# EAGLE design 1GHz Elektor Probe (EAGLE 6.1)
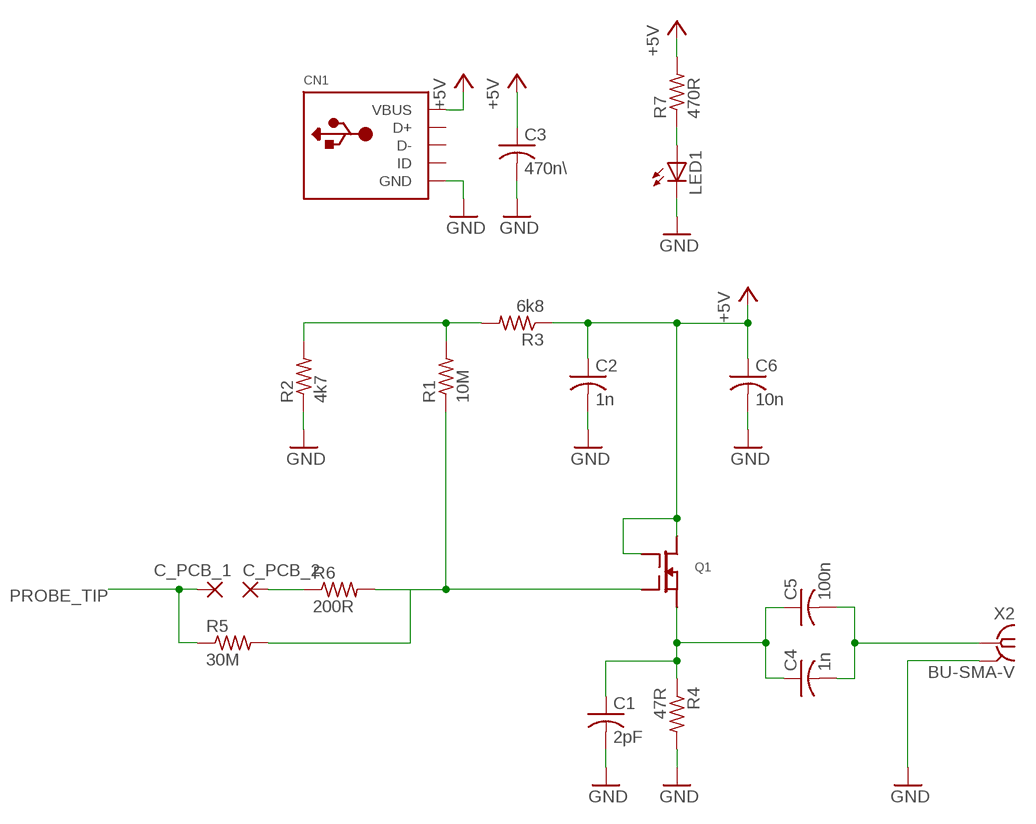
[diagram p0: schematic, sheet 1]

## Parts
C1  2pF  C-USC0805  [C0805]
C2  1n  C-USC0805  [C0805]
C3  470n\  C-USC0805  [C0805]
C4  1n  C-USC0805  [C0805]
C5  100n  C-USC0805  [C0805]
C6  10n  C-USC0805  [C0805]
C_PCB_1  SMD5  [SMD2,54-5,08]
C_PCB_2  SMD5  [SMD2,54-5,08]
CN1  USBMINIB  [USB-MINIB]
LED1  LED3MM  [LED3MM]
Q1  BF998  [SOT143B]
R1  10M  R-US_R0805  [R0805]
R2  4k7  R-US_R0805  [R0805]
R3  6k8  R-US_R0805  [R0805]
R4  47R  R-US_R0805  [R0805]
R5  30M  R-US_R0805  [R0805]
R6  200R  R-US_R0805  [R0805]
R7  470R  R-US_R0805  [R0805]
X2  BU-SMA-V  [BU-SMA-V]

## Nets
+5V: C2.1 C3.1 C6.1 CN1.VBUS Q1.2(D) Q1.3(G2) R3.1 R7.2
GND: C1.2 C2.2 C3.2 C6.2 CN1.GND LED1.K(C) R2.1 R4.2 X2.2(GND)
N$1: C1.1 C4.1 C5.1 Q1.1(S) R4.1
N$2: C_PCB_2.1(P) R6.1
N$3: R1.2 R2.2 R3.2
N$4: LED1.A R7.1
N$5: C4.2 C5.2 X2.1
N$6: Q1.4(G1) R1.1 R5.2 R6.2
PROBE_TIP: C_PCB_1.1(P) R5.1
Unconnected: CN1.D+ CN1.D- CN1.ID

## Power pins joined to a net without a drawn wire
GND: X2.3(GND) X2.4(GND) X2.5(GND)

## Library data of the parts
C1-C6 = rcl:C-US: CAPACITOR, American symbol
C_PCB_1 C_PCB_2 = wirepad:SMD5: SMD PAD
CN1 = adafruit:USB: USB Connectors USBMINIB - Surface Mount Female Mini-B USB Connector 4UConnector: 06564 By microbuilder.eu Thru-hole RA Female Mini-B USB Connector 4UConnector: 18732 By ladyada.net
LED1 = led:LED: LED OSRAM: - CHIPLED LG R971, LG N971, LY N971, LG Q971, LY Q971, LO R971, LY R971 LH N974, LH R974 LS Q976, LO Q976, LY Q976 LO Q996 - Hyper CHIPLED LW Q18S LB Q993, LB Q99A, LB R99A - SideLED LS A670, LO A670, LY A670, LG A670, LP A670 LB A673, LV A673, LT A673, LW A673 LH A674 LY A675 LS A676, LA A676, LO A676, LY A676, LW A676 LS A679, LY A679, LG A679 - Hyper Micro SIDELED® LS Y876, LA Y876, LO Y876, LY Y876 LT Y87S - SmartLED LW L88C, LW L88S LB L89C, LB L89S, LG L890 LS L89K, LO L89K, LY L89K LS L896, LA L896, LO L896, LY L896 - TOPLED LS T670, LO T670, LY T670, LG T670, LP T670 LSG T670, LSP T670, LSY T670, LOP T670, LYG T670 LG T671, LOG T671, LSG T671 LB T673, LV T673, LT T673, LW T673 LH T674 LS T676, LA T676, LO T676, LY T676, LB T676, LH T676, LSB T676, LW T676 LB T67C, LV T67C, LT T67C, LS T67K, LO T67K, LY T67K, LW E67C LS E67B, LA E67B, LO E67B, LY E67B, LB E67C, LV E67C, LT E67C LW T67C LS T679, LY T679, LG T679 LS T770, LO T770, LY T770, LG T770, LP T770 LB T773, LV T773, LT T773, LW T773 LH T774 LS E675, LA E675, LY E675, LS T675 LS T776, LA T776, LO T776, LY T776, LB T776 LHGB T686 LT T68C, LB T68C - Hyper Mini TOPLED® LB M676 - Mini TOPLED Santana® LG M470 LS M47K, LO M47K, LY M47K Source: http://www.osram.convergy.de LUXEON: - LUMILED® LXK2-PW12-R00, LXK2-PW12-S00, LXK2-PW14-U00, LXK2-PW14-V00 LXK2-PM12-R00, LXK2-PM12-S00, LXK2-PM14-U00 LXK2-PE12-Q00, LXK2-PE12-R00, LXK2-PE12-S00, LXK2-PE14-T00, LXK2-PE14-U00 LXK2-PB12-K00, LXK2-PB12-L00, LXK2-PB12-M00, LXK2-PB14-N00, LXK2-PB14-P00, LXK2-PB14-Q00 LXK2-PR12-L00, LXK2-PR12-M00, LXK2-PR14-Q00, LXK2-PR14-R00 LXK2-PD12-Q00, LXK2-PD12-R00, LXK2-PD12-S00 LXK2-PH12-R00, LXK2-PH12-S00 LXK2-PL12-P00, LXK2-PL12-Q00, LXK2-PL12-R00 Source: www.luxeon.com KINGBRIGHT: KA-3528ASYC Source: www.kingbright.com
Q1 = Kramnik's Library:BF998
R1-R7 = resistor:R-US_: RESISTOR, American symbol
X2 = con-coax:BU-SMA-V: FEMALE SMA CONNECTOR Radiall distributor RS 112-3794; OC_FARNELL: unknown; OC_NEWARK: unknown

## Board
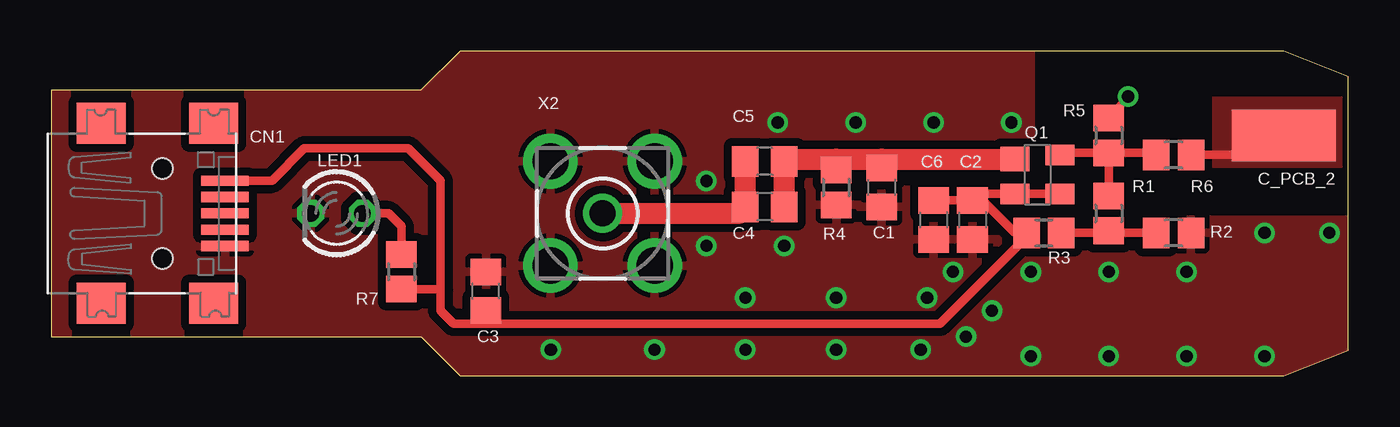
[diagram p1: board, top side]
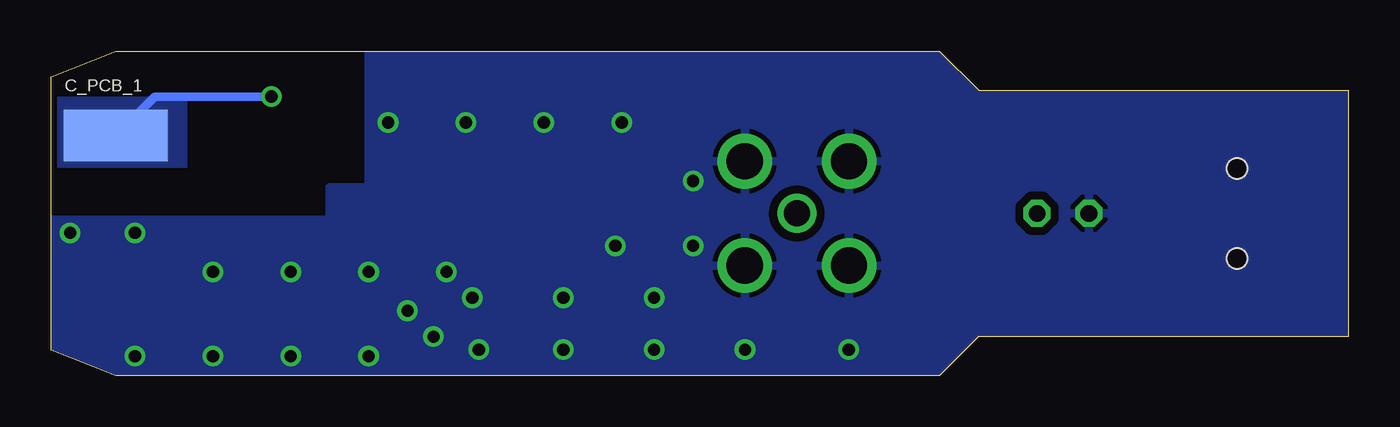
[diagram p2: board, bottom side, seen from below]

Size 63.48 x 15.88 mm. Coordinates in mm from the lower left corner, seen from the top.
Outline: 0,1.91 18.1,1.91 20,0 60.33,0 63.48,1.25 63.48,14.62 60.33,15.88 20,15.88 18.09,13.96 0,13.96 0,1.91
Copper layers (1*16): Top 0.035mm / dielectric 1.5mm / Bottom 0.035mm
Design rules: minimum track width 10mil, minimum drill 24mil, track to track 16mil, track to pad 16mil, pad to pad 16mil, via to via 16mil, smd to smd 0mil, copper to edge 1mil, drill to drill 8mil, minimum pad ring 10mil, minimum via ring 8mil, stop-mask expansion 4mil, vias tented up to drill 0mil, thermal gap 10mil

### Footprints (pad centres in the part's own frame; a part is rotated, then mirrored left to right if it is on the bottom)
C0805 = smd 1.3 x 1.5: 1 -0.95,0; 2 0.95,0
SMD2,54-5,08 = smd 2.54 x 5.08: 1 0,0
USB-MINIB = smd 0.5 x 2.308: D+ 0,4.064; D- -0.8,4.064; GND 1.6,4.064; ID 0.8,4.064; VBUS -1.6,4.064 | smd 2 x 2.4: GND1 -4.4,-2; GND2 -4.4,3.5; GND3 4.4,3.5; GND4 4.4,-2 | hole 1: -2.2,1; 2.2,1
LED3MM = drill 0.813 octagon: A -1.27,0; K 1.27,0
SOT143B = smd 1.2 x 1.44: 1 -0.75,-1.1 | smd 1 x 1.44: 2 0.95,-1.1; 3 0.95,1.1; 4 -0.95,1.1
R0805 = smd 1.3 x 1.5: 1 -0.85,0; 2 0.85,0
BU-SMA-V = drill 1.27: 1 0,0 | drill 1.778: 2 -2.55,2.55; 3 2.55,2.55; 4 2.55,-2.55; 5 -2.55,-2.55

### Placement (x,y rotation side)
C1  40.64,9.21 270 top
C2  45.09,7.62 270 top
C3  21.27,4.13 90 top
C4  34.92,8.26 180 top
C5  34.92,10.48 180 top
C6  43.18,7.62 270 top
C_PCB_1  60.33,11.75 270 bottom
C_PCB_2  60.33,11.75 90 top
CN1  4.45,7.94 270 top
LED1  13.97,7.94 180 top
Q1  48.26,9.84 270 top
R1  51.75,7.94 270 top
R2  54.93,6.99 180 top
R3  48.58,6.99 0 top
R4  38.42,9.21 270 top
R5  51.75,11.75 270 top
R6  54.93,10.79 180 top
R7  17.14,5.08 270 top
X2  26.99,7.94 0 top

### Tracks (layer width: path | path; a pad name or v marks a point on that pad's centre or on a via)
+5V
  Top 0.406: Q1.3 Q1.2 45.41,8.89 C2.1 | C2.1 45.56,8.57 47.15,6.99 R3.1 47.31,6.57 47.31,6.35 43.5,2.54 21.27,2.54 | C6.1 C2.1 | 21.27,2.54 19.68,2.54 19.05,3.17 19.05,4.13 19.05,4.23 | 19.05,4.23 19.05,9.53 17.46,11.11 12.38,11.11 10.81,9.54 CN1.VBUS | C3.1 21.27,2.54 | R7.2 19.05,4.23
GND  (via drill 0.6)
  other vias: 62.55,6.99 51.75,5.08 59.37,6.99 59.37,0.95 51.75,0.95 44.77,1.91 47.94,5.08 42.55,1.27 44.13,5.08 38.42,1.27 33.97,1.27 29.53,1.27 42.86,3.81 38.42,3.81 33.97,3.81 46.04,3.17 47.94,0.95 24.45,1.27 55.56,5.08 55.56,0.95 32.07,6.35 32.07,9.53 46.99,12.38 43.18,12.38 39.37,12.38 35.88,6.35 35.56,12.38
  pour Top: -3.81,0 67.63,0 67.63,7.62 49.85,7.62 49.85,9.21 47.94,9.21 47.94,15.88 -3.81,15.88
  pour Bottom: -3.81,-0.32 -3.81,16.19 47.94,16.19 47.94,9.21 49.85,9.21 49.85,7.62 67.63,7.62 67.63,-0.32
N$1
  Top 0.406: 35.99,10.59 C5.1
  Top 1.016: C4.1 C5.1 | 35.99,10.59 38.42,10.59 | 38.42,10.59 40.64,10.59 | 40.64,10.59 Q1.1 | C1.1 40.64,10.59 | R4.1 38.42,10.59
N$2
  Top 0.406: R6.1 59.37,10.79 C_PCB_2.1
  pour Top (no thermals): 56.83,13.65 63.18,13.65 63.18,10.16 56.83,10.16
N$3
  Top 0.406: R3.2 51.44,6.99 | 51.44,6.99 R2.2 | R1.2 51.54,7.09 51.44,6.99
N$4
  Top 0.406: R7.1 17.14,7.3 16.51,7.94 LED1.A
N$5
  Top 1.016: X2.1 33.66,7.94 C4.2 C5.2
N$6
  Top 0.406: R5.2 R1.1 | R5.2 49.47,10.9 Q1.4 | R5.2 53.98,10.9 R6.2
PROBE_TIP  (via drill 0.6)
  Top 0.406: R5.1 v52.7,13.65
  Bottom 0.406: C_PCB_1.1 58.42,13.65 v52.7,13.65
  pour Bottom (no thermals): 56.83,10.16 56.83,13.65 63.18,13.65 63.18,10.16